# Altium schematic sheet 1_Interface.SchDoc
size A4; Organization: SpaceLab UFSC; Address1: UFSC - SpaceLab; Address2: University Campus - Trindade; Address3: Dep. of Electrical Engineering - CTC; Address4: Florianópolis, Santa Catarina, Brazil; Address5: CEP: 88040 - 900
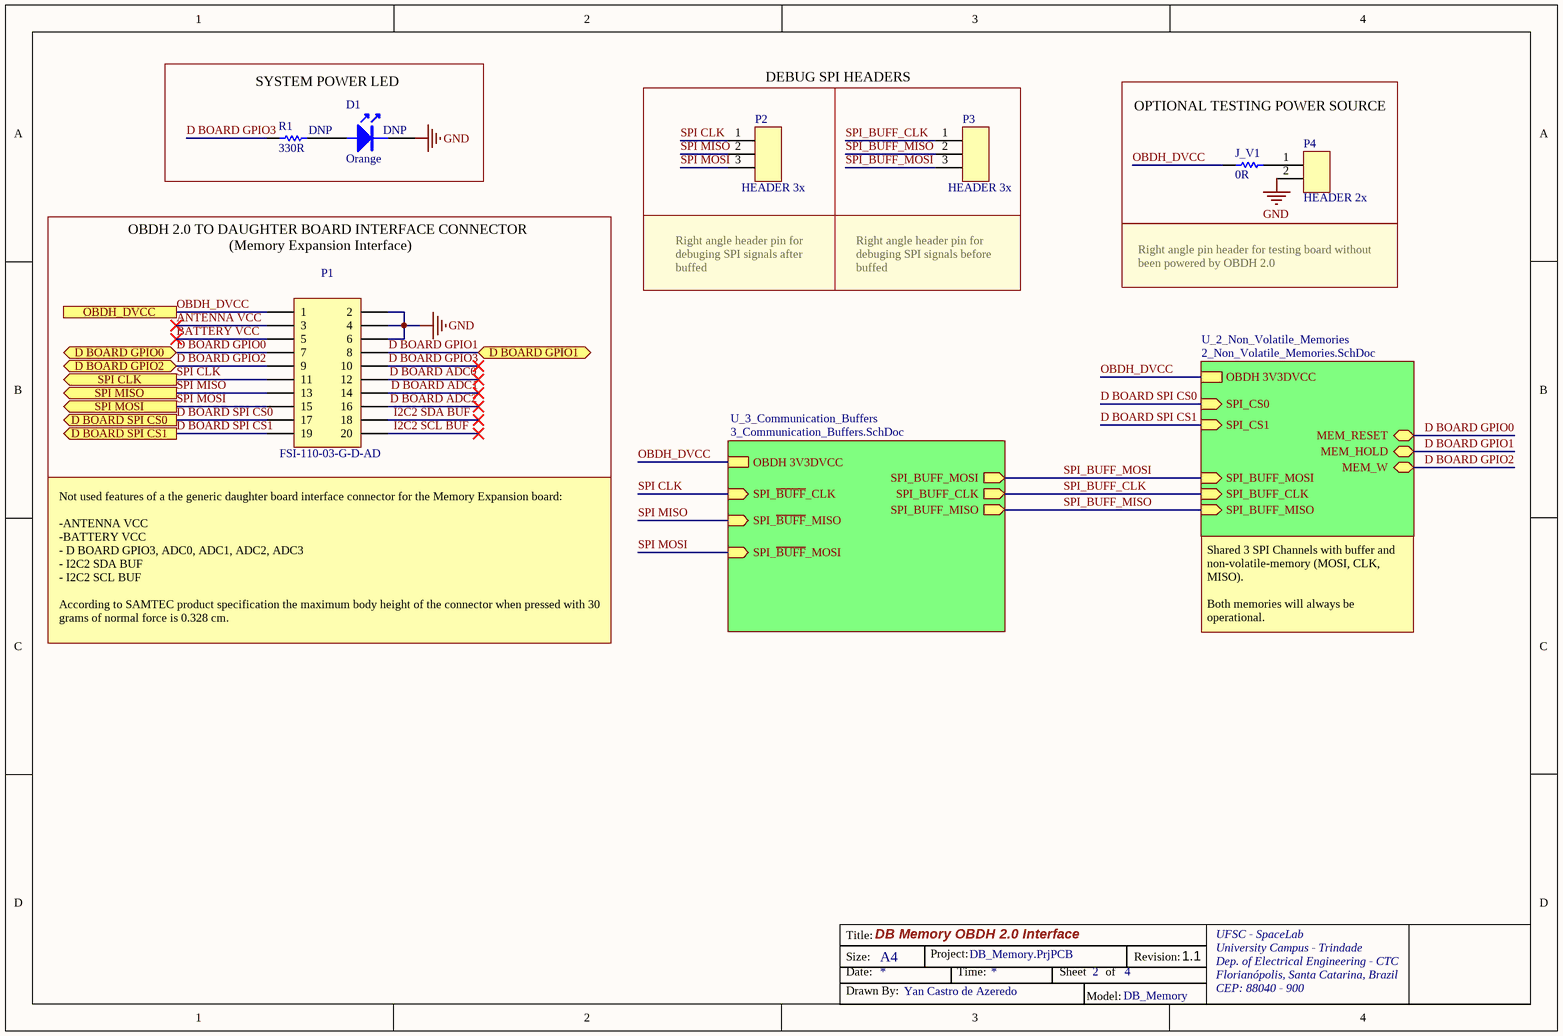
[diagram p0: 1_Interface.SchDoc]

## Parts
D1  Orange  [0805-LED]
J_V1  0R  [0805]
P1  FSI-110-03-G-D-AD  [Mating FSI-110-03-G-D-AD]
P2  HEADER 3x  [Header1x3]
P3  HEADER 3x  [Header1x3]
P4  HEADER 2x  [HEADER 1X2]
R1  330R  [0805]

## Blocks framed on the sheet
SYSTEM POWER LED: D1 R1
OPTIONAL TESTING POWER SOURCE: J_V1 P4
DEBUG SPI HEADERS: P2 P3

## Sub-sheets
U_2_Non_Volatile_Memories = 2_Non_Volatile_Memories.SchDoc: SPI_CS1 (in), SPI_CS0 (in), MEM_RESET (bidir), MEM_HOLD (bidir), MEM_W (bidir), SPI_BUFF_MOSI (in), SPI_BUFF_CLK (in), SPI_BUFF_MISO (in), OBDH 3V3DVCC
U_3_Communication_Buffers = 3_Communication_Buffers.SchDoc: SPI_BUFF_MOSI (out), SPI_BUFF_CLK (out), SPI_BUFF_MISO (out), SPI_~{BUFF}_MISO (in), SPI_~{BUFF}_CLK (in), SPI_~{BUFF}_MOSI (in), OBDH 3V3DVCC

## Ports
D BOARD GPIO0 (bidir), D BOARD GPIO1 (bidir), D BOARD GPIO2 (bidir), D BOARD SPI CS0 (out), D BOARD SPI CS1 (out), OBDH_DVCC, SPI CLK (out), SPI MISO (out), SPI MOSI (out)

## Nets
GND: D1.2(K) P1.2 P1.4 P1.6 P4.2
ANTENNA VCC: P1.3
BATTERY VCC: P1.5
D BOARD ADC0: P1.12
D BOARD ADC1: P1.14
D BOARD ADC2: P1.16
D BOARD GPIO0: P1.7 ; port D BOARD GPIO0, sheet U_2_Non_Volatile_Memories/MEM_RESET
D BOARD GPIO1: P1.8 ; port D BOARD GPIO1, sheet U_2_Non_Volatile_Memories/MEM_HOLD
D BOARD GPIO2: P1.9 ; port D BOARD GPIO2, sheet U_2_Non_Volatile_Memories/MEM_W
D BOARD GPIO3: P1.10 R1.1
D BOARD SPI CS0: P1.17 ; port D BOARD SPI CS0, sheet U_2_Non_Volatile_Memories/SPI_CS0
D BOARD SPI CS1: P1.19 ; port D BOARD SPI CS1, sheet U_2_Non_Volatile_Memories/SPI_CS1
I2C2 SCL BUF: P1.20
I2C2 SDA BUF: P1.18
OBDH_DVCC: J_V1.2 P1.1 ; port OBDH_DVCC, sheet U_2_Non_Volatile_Memories/OBDH 3V3DVCC, sheet U_3_Communication_Buffers/OBDH 3V3DVCC
SPI CLK: P1.11 P2.1 ; port SPI CLK, sheet U_3_Communication_Buffers/SPI_~{BUFF}_CLK
SPI MISO: P1.13 P2.2 ; port SPI MISO, sheet U_3_Communication_Buffers/SPI_~{BUFF}_MISO
SPI MOSI: P1.15 P2.3 ; port SPI MOSI, sheet U_3_Communication_Buffers/SPI_~{BUFF}_MOSI
SPI_BUFF_CLK: P3.1 ; sheet U_2_Non_Volatile_Memories/SPI_BUFF_CLK, sheet U_3_Communication_Buffers/SPI_BUFF_CLK
SPI_BUFF_MISO: P3.2 ; sheet U_2_Non_Volatile_Memories/SPI_BUFF_MISO, sheet U_3_Communication_Buffers/SPI_BUFF_MISO
SPI_BUFF_MOSI: P3.3 ; sheet U_2_Non_Volatile_Memories/SPI_BUFF_MOSI, sheet U_3_Communication_Buffers/SPI_BUFF_MOSI
NetD1_1: D1.1(A) R1.2
NetJ_V1_1: J_V1.1 P4.1

## Notes on the sheet
- (near R1) DNP
- (near D1) DNP
- OBDH 2.0 TO DAUGHTER BOARD INTERFACE CONNECTOR
- (Memory Expansion Interface)
- Right angle header pin for debuging SPI signals after buffed
- Right angle header pin for debuging SPI signals before buffed
- Right angle pin header for testing board without been powered by OBDH 2.0
- Not used features of a the generic daughter board interface connector for the Memory Expansion board:
  -ANTENNA VCC
  -BATTERY VCC
  - D BOARD GPIO3, ADC0, ADC1, ADC2, ADC3
  - I2C2 SDA BUF
  - I2C2 SCL BUF
  According to SAMTEC product specification the maximum body height of the connector when pressed with 30 grams of normal force is 0.328 cm.
- Shared 3 SPI Channels with buffer and non-volatile-memory (MOSI, CLK, MISO).
  Both memories will always be operational.
- DB Memory OBDH 2.0 Interface
- DB_Memory.PrjPCB
- 2
- 4
- 1.1
- Yan Castro de Azeredo
- DB_Memory
- Title:
- Size:
- Date:
- A4
- Project:
- Time:
- Sheet
- of
- Revision:
- UFSC - SpaceLab
- University Campus - Trindade
- Dep. of Electrical Engineering - CTC
- Florianópolis, Santa Catarina, Brazil
- CEP: 88040 - 900
- Drawn By:
- Model:

## Library data of the parts
D1 = LED/O_0802: SMD Orange LED; Partnumber: LTST-C170KFKT; Manufacturer: Vishay Lite-On; Dominant Wavelength: 605nm; Forward Current: 30mA; Forward Voltage: 2V; Lens Color: Colorless; Lens Style: Diffused,Colorless,Rectangular,Clear; Lens Transparency: Clear; Luminous Intensity: 60mcd; Number of Elements: 1; Power Dissipation: 75mW; Reverse Voltage: 5V; Test Current: 20mA; Viewing Angle: 130°; Wavelength: 611nm; NCM: 8541.40.21; ComponentLink1Description: https://www.digikey.com/product-detail/en/lite-on-inc/LTST-C170KFKT/160-1413-1-ND/386774; ComponentLink1URL: https://www.digikey.com/product-detail/en/lite-on-inc/LTST-C170KFKT/160-1413-1-ND/386774; ComponentLink2Description: https://br.mouser.com/ProductDetail/Lite-On/LTST-C170KFKT?qs=%2Fha2pyFadugHsX7bdQzWjMrioqtf8F%2FEFUVxYkqdVx%252BrRWuVMVludQ%3D%3D; ComponentLink2URL: https://br.mouser.com/ProductDetail/Lite-On/LTST-C170KFKT?qs=%2Fha2pyFadugHsX7bdQzWjMrioqtf8F%2FEFUVxYkqdVx%252BrRWuVMVludQ%3D%3D; Case/Package: 0805; Case Code (Imperial): 0805; Case Code (Metric): 2012; Color: Orange; ComponentLink3Description: https://www.verical.com/server-webapp/html/getDatasheet?partID=158266&src-supplier=Verical; ComponentLink3URL: https://www.verical.com/server-webapp/html/getDatasheet?partID=158266&src-supplier=Verical; ComponentLink4Description: http://optoelectronics.liteon.com/upload/download/DS-22-99-0185/LTST-C170KFKT.pdf?src-supplier=Digi-Key; ComponentLink4URL: http://optoelectronics.liteon.com/upload/download/DS-22-99-0185/LTST-C170KFKT.pdf?src-supplier=Digi-Key; ComponentLink5Description: http://www1.futureelectronics.com/doc/LITE-ON/LTST-C170KFKT.pdf?src-supplier=Future+Electronics; ComponentLink5URL: http://www1.futureelectronics.com/doc/LITE-ON/LTST-C170KFKT.pdf?src-supplier=Future+Electronics; ComponentLink6Description: http://www.mouser.com/ds/2/239/Lite-On-LTST-C170KFKT-187690.pdf?src-supplier=Mouser; ComponentLink6URL: http://www.mouser.com/ds/2/239/Lite-On-LTST-C170KFKT-187690.pdf?src-supplier=Mouser; Depth: 1.6mm; Height: 1.1mm; Illumination Color: Orange; Lead Free: Lead Free; Length: 3.2mm; Manufacturer Part Number: LTST-C170KFKT; Max Operating Temperature: 85°C; Min Operating Temperature: -55°C; Mount: Surface Mount; Number of LEDs: 1; Number of Pins: 2; Package Quantity: 1; Packaging: Tape and Reel; Power Rating: 75mW; Pricing 1: 1=0.28, 10=0.204, 100=0.0968, 500=0.0645, 1000=0.05053 (USD); Pricing 2: 1=0.28, 10=0.15, 100=0.07, 1000=0.051, 3000=0.043, 9000=0.039, 24000=0.035, 45000=0.032, 99000=0.03 (USD); Radiation Hardening: No; Stock 1: 5261; Stock 2: 0; Supplier 1: Digi-Key; Supplier 2: Mouser; Supplier Part Number 1: 160-1413-1-ND; Supplier Part Number 2: 859-LTST-C170KFKT; Width: 1.25mm
J_V1 = RC0805JR-070RL: RES 0R OHM 1/8W JUMPER 0805; Partnumber: CRCW08050000Z0EA; Manufacturer: Yageo; Resistance: 0mR; Tolerance: 5%; Power Rating: 125mW; Voltage Rating: 150V; Temperature Coefficient: 200ppm/°C; NCM: 8533.21.20; Supplier 1: Digi-Key; Supplier Part Number 1: 311-0.0ARCT-ND; Stock 1: 10579520; Pricing 1: 1=0.1, 10=0.035, 25=0.0248, 50=0.019, 100=0.014, 250=0.01072, 500=0.00856, 1000=0.00631 (USD); Case/Package: 0805; Number of Pins: 2; Contact Plating: Tin,Matte; Case Code (Imperial): 0805; Case Code (Metric): 2012; Min Operating Temperature: -55°C; Max Operating Temperature: 155°C; Composition: Thick Film; Packaging: Tape and Reel; Voltage Rating (DC): 150V; Termination: SMD/SMT; Military Standard: Not; Length: 2mm; Height: 0.5mm; Width: 1.25mm; Depth: 1.25mm; Radiation Hardening: No; REACH SVHC: Unknown; Lead Free: Lead Free; ComponentLink1URL: http://www.farnell.com/datasheets/2167052.pdf?src-supplier=Element14; ComponentLink1Description: http://www.farnell.com/datasheets/2167052.pdf?src-supplier=Element14; ComponentLink2URL: http://documents.rs-components.com/techlib://itc_doclist_GB.htm?stockno=6185129&src-supplier=RSComponents; ComponentLink2Description: http://documents.rs-components.com/techlib://itc_doclist_GB.htm?stockno=6185129&src-supplier=RSComponents; ComponentLink3URL: https://www.verical.com/server-webapp/html/getDatasheet?partID=330685&src-supplier=Verical; ComponentLink3Description: https://www.verical.com/server-webapp/html/getDatasheet?partID=330685&src-supplier=Verical; Supplier 2: Mouser; Supplier Part Number 2: 603-RC0805JR-070RL; Stock 2: 658275; Pricing 2: 1=0.1, 10=0.005, 100=0.005, 1000=0.005, 5000=0.004, 10000=0.004 (USD); Manufacturer Part Number: RC0805JR-070RL
P1 = FSI-110-03-G-D-AD: CONN STACKING 20POS SMD GOLD; Manufacturer: Samtec; Gender: Male; Number of Contacts: 20; Pitch: 1mm; Value: *; Partnumber: FSI-110-03-G-D-AD; ComponentLink1Description: https://www.digikey.com/product-detail/en/samtec-inc/FSI-110-03-G-D-AD/SAM9412-ND/6678149; ComponentLink1URL: https://www.digikey.com/product-detail/en/samtec-inc/FSI-110-03-G-D-AD/SAM9412-ND/6678149; ComponentLink2Description: https://br.mouser.com/ProductDetail/Samtec/FSI-110-03-G-D-AD?qs=sGAEpiMZZMvffgRu4KC1RxM6nKwEP14AvPoIU%2FGiIRnIunfAN0MvNQ%3D%3D; ComponentLink2URL: https://br.mouser.com/ProductDetail/Samtec/FSI-110-03-G-D-AD?qs=sGAEpiMZZMvffgRu4KC1RxM6nKwEP14AvPoIU%2FGiIRnIunfAN0MvNQ%3D%3D; ComponentLink3Description: http://www.samtec.com/ftppub/pdf/FSI_03.PDF?src-supplier=Avnet+Europe; ComponentLink3URL: http://www.samtec.com/ftppub/pdf/FSI_03.PDF?src-supplier=Avnet+Europe; Contact Material: Copper; Contact Plating: Gold; Manufacturer Part Number: FSI-110-03-G-D-AD; Mount: Surface Mount; Number of Rows: 2; Pricing 1: 1=6.6, 10=6.325, 25=5.7752, 50=5.5, 100=5.225, 250=4.675, 500=4.4, 1000=3.85, 2500=3.6575 (USD); Pricing 2: 1=6.59, 10=5.5, 100=4.68, 250=4.17, 500=3.84, 1000=3.6 (USD); Radiation Hardening: No; REACH SVHC: No SVHC; Stock 1: 100; Stock 2: 50; Supplier 1: Digi-Key; Supplier 2: Mouser; Supplier Part Number 1: SAM9412-ND; Supplier Part Number 2: 200-FSI11003GDAD; Termination: Solder
P2 P3 = HEADER 3x: Conn Unshrouded Header HDR 3 POS 2.54mm Solder RA Thru-Hole Automotive Bulk; Manufacturer: Samtec; Manufacturer Part Number: TSW-103-08-G-S-RA; Number of Contacts: 3; Connector Type: Male Pin; Gender: Male; Max Current Rating: 7.6A; Max Voltage Rating (AC): 450V; Supplier 1: Digi-Key; Stock 1: 2099; Pricing 1: 1=0.43, 10=0.403, 25=0.3456, 50=0.2938, 100=0.2822, 250=0.25344, 500=0.24192 (USD); Contact Plating: Gold; Contact Material: Bronze; Color: Black; Housing Color: Black; Housing Material: Polyester; Min Operating Temperature: -55°C; Max Operating Temperature: 125°C; Number of Rows: 1; Termination: Solder; Packaging: Bulk; Number of Positions: 3; Package Quantity: 1; Orientation: Right Angle; Length: 7.62mm; Pitch: 2.54mm; Depth: 9.9mm; Contact Mating Length: 0.23inch; Width: 2.54mm; Radiation Hardening: No; REACH SVHC: No SVHC; Lead Free: Lead Free; Supplier Part Number 1: SAM1039-03-ND; ComponentLink4Description: https://www.digikey.com/product-detail/en/samtec-inc/TSW-103-08-G-S-RA/SAM1039-03-ND/1101821; ComponentLink4URL: https://www.digikey.com/product-detail/en/samtec-inc/TSW-103-08-G-S-RA/SAM1039-03-ND/1101821; ComponentLink5Description: https://br.mouser.com/ProductDetail/Samtec/TSW-103-08-G-S-RA?qs=sGAEpiMZZMs%252BGHln7q6pm1g2HIpDMMemHovqpYNR5zQ9xV6Y7S0zpg%3D%3D; ComponentLink5URL: https://br.mouser.com/ProductDetail/Samtec/TSW-103-08-G-S-RA?qs=sGAEpiMZZMs%252BGHln7q6pm1g2HIpDMMemHovqpYNR5zQ9xV6Y7S0zpg%3D%3D; ComponentLink1URL: http://www.samtec.com/ftppub/pdf/htsw_th.pdf?src-supplier=Avnet+Europe; ComponentLink1Description: http://www.samtec.com/ftppub/pdf/htsw_th.pdf?src-supplier=Avnet+Europe; ComponentLink2URL: http://www.samtec.com/ftppub/pdf/htsw_th.pdf?src-supplier=Avnet; ComponentLink2Description: http://www.samtec.com/ftppub/pdf/htsw_th.pdf?src-supplier=Avnet; ComponentLink3URL: http://suddendocs.samtec.com/prints/tsw-xxx-xx-x-x-xx-xxx-footprint.pdf?src-supplier=Digi-Key; ComponentLink3Description: http://suddendocs.samtec.com/prints/tsw-xxx-xx-x-x-xx-xxx-footprint.pdf?src-supplier=Digi-Key; Supplier 2: Mouser; Supplier Part Number 2: 200-TSW10308GSRA; Stock 2: 1859; Pricing 2: 1=0.44, 10=0.303, 100=0.249, 1000=0.208, 2500=0.178, 10000=0.16 (USD)
P4 = HEADER 2x: Conn Unshrouded Header HDR 2 POS 2.54mm Solder RA Thru-Hole Automotive Bulk; Manufacturer: Samtec; Manufacturer Part Number: TSW-102-08-G-S-RA; Number of Positions: 2; Connector Type: Male Pin; Gender: Male; Max Current Rating: 7.6A; Max Voltage Rating (AC): 450V; Supplier 1: Digi-Key; Stock 1: 681; Pricing 1: 1=0.28, 10=0.269, 25=0.2304, 50=0.1958, 100=0.1882, 250=0.16896, 500=0.16128 (USD); Contact Plating: Gold; Contact Material: Bronze; Color: Black; Housing Color: Black; Housing Material: Polyester; Min Operating Temperature: -55°C; Max Operating Temperature: 125°C; Number of Rows: 1; Termination: Solder; Packaging: Bulk; Number of Contacts: 2; Orientation: Right Angle; Package Quantity: 1; Length: 5.08mm; Pitch: 2.54mm; Width: 2.54mm; Depth: 9.9mm; Contact Mating Length: 0.23inch; Radiation Hardening: No; Lead Free: Lead Free; REACH SVHC: No SVHC; ComponentLink1URL: http://www.samtec.com/ftppub/pdf/htsw_th.pdf?src-supplier=Avnet; ComponentLink1Description: http://www.samtec.com/ftppub/pdf/htsw_th.pdf?src-supplier=Avnet; ComponentLink2URL: http://suddendocs.samtec.com/prints/tsw-xxx-xx-x-x-xx-xxx-footprint.pdf?src-supplier=Digi-Key; ComponentLink2Description: http://suddendocs.samtec.com/prints/tsw-xxx-xx-x-x-xx-xxx-footprint.pdf?src-supplier=Digi-Key; Supplier Part Number 1: SAM1039-02-ND; ComponentLink3Description: https://www.digikey.com/product-detail/en/samtec-inc/TSW-102-08-G-S-RA/SAM1039-02-ND/1101822; ComponentLink3URL: https://www.digikey.com/product-detail/en/samtec-inc/TSW-102-08-G-S-RA/SAM1039-02-ND/1101822; ComponentLink4Description: https://br.mouser.com/ProductDetail/Samtec/TSW-102-08-G-S-RA?qs=sGAEpiMZZMs%252BGHln7q6pm8Vn94ktop%2FJ1uezLg%252BX1dFCcXJp94NfRw%3D%3D; ComponentLink4URL: https://br.mouser.com/ProductDetail/Samtec/TSW-102-08-G-S-RA?qs=sGAEpiMZZMs%252BGHln7q6pm8Vn94ktop%2FJ1uezLg%252BX1dFCcXJp94NfRw%3D%3D; Pricing 2: 1=0.29, 10=0.203, 100=0.167, 1000=0.14, 2500=0.119, 10000=0.108 (USD); Stock 2: 90; Supplier 2: Mouser; Supplier Part Number 2: 200-TSW10208GSRA
R1 = R330R_1%_1/4W_0805: RES 330R OHM 1/4W 1% 0805; Partnumber: RC0805FR-07330RL; Manufacturer: KOA Speer; Manufacturer Part Number: RK73H2ATTD3300F; Power Rating: 125mW; Temperature Coefficient: 100ppm/°C; Voltage Rating: 150V; NCM: 8533.21.20; Case/Package: 0805; Case Code (Imperial): 0805; Case Code (Metric): 2012; ComponentLink1Description: https://www.digikey.com/product-detail/en/koa-speer-electronics-inc/RK73H2ATTD3300F/2019-RK73H2ATTD3300FCT-ND/10235463; ComponentLink1URL: https://www.digikey.com/product-detail/en/koa-speer-electronics-inc/RK73H2ATTD3300F/2019-RK73H2ATTD3300FCT-ND/10235463; ComponentLink2Description: https://br.mouser.com/ProductDetail/KOA-Speer/RK73H2ATTD3300F?qs=%2Fha2pyFadugxRkEvlrt8CF%252BQdweyO24kpRel1WKIEPxDUp0ygGBU5A%3D%3D; ComponentLink2URL: https://br.mouser.com/ProductDetail/KOA-Speer/RK73H2ATTD3300F?qs=%2Fha2pyFadugxRkEvlrt8CF%252BQdweyO24kpRel1WKIEPxDUp0ygGBU5A%3D%3D; ComponentLink3Description: http://www.koaspeer.com/catimages/Products/RK73H/RK73H.pdf?src-supplier=Mouser; ComponentLink3URL: http://www.koaspeer.com/catimages/Products/RK73H/RK73H.pdf?src-supplier=Mouser; ComponentLink4Description: http://www.farnell.com/datasheets/1832268.pdf?src-supplier=Element14; ComponentLink4URL: http://www.farnell.com/datasheets/1832268.pdf?src-supplier=Element14; Composition: Thick Film; Depth: 1.25mm; Height: 0.5mm; Lead Free: Lead Free; Length: 2mm; Max Operating Temperature: 155°C; Military Standard: Not; Min Operating Temperature: -55°C; Package Quantity: 5000; Packaging: Tape and Reel; Pricing 1: 1=0.1, 10=0.033, 100=0.0136, 1000=0.00612, 2500=0.00531 (USD); Pricing 2: 1=0.1, 10=0.033, 100=0.013, 1000=0.005, 5000=0.005, 10000=0.004 (USD); REACH SVHC: Unknown; Resistance: 330R; Stock 1: 55895; Stock 2: 0; Supplier 1: Digi-Key; Supplier 2: Mouser; Supplier Part Number 1: 2019-RK73H2ATTD3300FCT-ND; Supplier Part Number 2: 660-RK73H2ATTD3300F; Termination: SMD/SMT; Tolerance: 1%; Width: 1.25mm